# Altium schematic sheet RS-485 Transceiver.SchDoc
size A; SheetNumber: 18; SheetTotal: 19
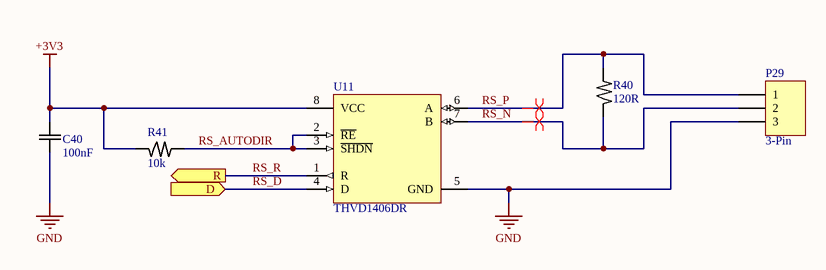
[diagram p0: RS-485 Transceiver.SchDoc]

## Parts
C40  100nF  [C0603]
P29  3-Pin  [Spring Terminal Block 3-Pin]
R40  120R  [R0603]
R41  10k  [R0603]
U11  THVD1406DR  [SOIC-8]

## Ports
D (in), R (out)

## Nets
+3V3: C40.2 R41.2 U11.8(VCC)
GND: C40.1 P29.3 U11.5(GND)
RS_AUTODIR: R41.1 U11.2(~{RE}) U11.3(~{SHDN})
RS_D: U11.4(D) ; port D
RS_N: P29.2 R40.2 U11.7(B)
RS_P: P29.1 R40.1 U11.6(A)
RS_R: U11.1(R) ; port R

## Layout directives
differential pair: RS_N, RS_P

## Notes on the sheet
- Project:
- Sheet Title:
- Size
- Date:
- A
- Sheet Number:
- Sheet Total:
- Revision:
- Time:
- Author:

## Library data of the parts
C40 = Cap_cer: CAP CER 100nF 50V X7R 0603; MF: HRE; MP: CGA0603X7R104K500JT; ComponentLink1Description: Datasheet; ComponentLink1URL: https://www.lcsc.com/datasheet/C6119867.pdf; ComponentLink2Description: Supplier1; ComponentLink2URL: https://www.lcsc.com/product-detail/C6119867.html
P29 = Spring Terminal 3-Pin: 3 Position Wire to Board Terminal Block 2.54mm Through Hole, Right Angle; MF: DORABO; MP: DB141R-2.54-3P-GN; ComponentLink1Description: Datasheet; ComponentLink1URL: https://www.lcsc.com/datasheet/C2898755.pdf; ComponentLink2Description: Supplier1; ComponentLink2URL: https://www.lcsc.com/product-detail/C2898755.html?s_z=n_C2898755
R40 = Res: RES 120Ω ±1% 100mW 0603; MF: UNI-ROYAL; MP: 0603WAF1200T5E; ComponentLink1Description: Datasheet; ComponentLink1URL: https://www.lcsc.com/datasheet/C22787.pdf; ComponentLink2Description: Supplier1; ComponentLink2URL: https://www.lcsc.com/product-detail/C22787.html
R41 = Res: RES 10kΩ ±1% 100mW 0603; MF: FOJAN; MP: FRC0603F1002TS; ComponentLink1Description: Datasheet; ComponentLink1URL: https://www.lcsc.com/datasheet/C2906982.pdf; ComponentLink2Description: Supplier1; ComponentLink2URL: https://www.lcsc.com/product-detail/C2906982.html
U11 = THVD1406DR RS-485: 1/1 Transceiver Half RS422, RS485 SOIC-8; MF: Texas Instruments; MP: THVD1406DR; ComponentLink1Description: Supplier1; ComponentLink1URL: https://www.lcsc.com/product-detail/C5215918.html?s_z=n_C5215918; ComponentLink2Description: Datasheet; ComponentLink2URL: https://www.ti.com/lit/ds/symlink/thvd1406.pdf?ts=1766398260594